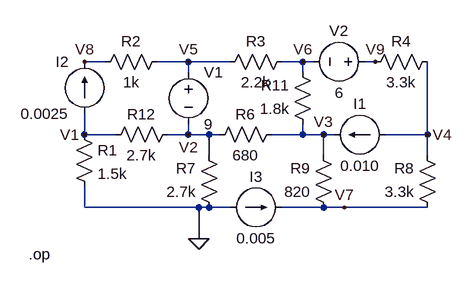
[diagram p0: schematic nodal14.asc]
nodal14.asc, the LTspice schematic file:
Version 4
SHEET 1 880 680
WIRE -32 -32 -64 -32
WIRE 96 -32 48 -32
WIRE 160 -32 96 -32
WIRE 272 -32 240 -32
WIRE 288 -32 272 -32
WIRE 384 -32 368 -32
WIRE 96 -16 96 -32
WIRE 272 -16 272 -32
WIRE -64 80 -64 48
WIRE -16 80 -64 80
WIRE 96 80 96 64
WIRE 96 80 64 80
WIRE 128 80 96 80
WIRE 144 80 128 80
WIRE 272 80 272 64
WIRE 272 80 224 80
WIRE 304 80 272 80
WIRE 320 80 304 80
WIRE 464 80 464 -32
WIRE 464 80 400 80
WIRE 128 112 128 80
WIRE 304 112 304 80
WIRE 464 112 464 80
WIRE -64 192 -64 160
WIRE 112 192 -64 192
WIRE 128 192 112 192
WIRE 160 192 128 192
WIRE 304 192 240 192
WIRE 336 192 304 192
WIRE 464 192 336 192
WIRE 112 240 112 192
FLAG 112 240 0
FLAG -64 80 V1
FLAG 96 80 V2
FLAG 304 80 V3
FLAG 464 80 V4
FLAG 96 -32 V5
FLAG 272 -32 V6
FLAG 336 192 V7
FLAG -64 -32 V8
FLAG 384 -32 V9
SYMBOL voltage 96 -32 R0
WINDOW 123 0 0 Left 0
WINDOW 39 0 0 Left 0
SYMATTR InstName V1
SYMATTR Value 9
SYMBOL voltage 384 -32 R90
WINDOW 0 -32 56 VBottom 2
WINDOW 3 32 56 VTop 2
WINDOW 123 0 0 Left 0
WINDOW 39 0 0 Left 0
SYMATTR InstName V2
SYMATTR Value 6
SYMBOL current 400 80 R90
WINDOW 0 -32 40 VBottom 2
WINDOW 3 32 40 VTop 2
WINDOW 123 0 0 Left 0
WINDOW 39 0 0 Left 0
SYMATTR InstName I1
SYMATTR Value 0.010
SYMBOL current -64 48 R180
WINDOW 0 24 80 Left 2
WINDOW 3 24 0 Left 2
WINDOW 123 0 0 Left 0
WINDOW 39 0 0 Left 0
SYMATTR InstName I2
SYMATTR Value 0.0025
SYMBOL res -80 64 R0
SYMATTR InstName R1
SYMATTR Value 1.5k
SYMBOL res 64 -48 R90
WINDOW 0 0 56 VBottom 2
WINDOW 3 32 56 VTop 2
SYMATTR InstName R2
SYMATTR Value 1k
SYMBOL res 256 -48 R90
WINDOW 0 0 56 VBottom 2
WINDOW 3 32 56 VTop 2
SYMATTR InstName R3
SYMATTR Value 2.2k
SYMBOL res 480 -48 R90
WINDOW 0 0 56 VBottom 2
WINDOW 3 32 56 VTop 2
SYMATTR InstName R4
SYMATTR Value 3.3k
SYMBOL res 240 64 R90
WINDOW 0 0 56 VBottom 2
WINDOW 3 32 56 VTop 2
SYMATTR InstName R6
SYMATTR Value 680
SYMBOL res 144 208 R180
WINDOW 0 36 76 Left 2
WINDOW 3 36 40 Left 2
SYMATTR InstName R7
SYMATTR Value 2.7k
SYMBOL res 480 208 R180
WINDOW 0 36 76 Left 2
WINDOW 3 36 40 Left 2
SYMATTR InstName R8
SYMATTR Value 3.3k
SYMBOL res 320 208 R180
WINDOW 0 36 76 Left 2
WINDOW 3 36 40 Left 2
SYMATTR InstName R9
SYMATTR Value 820
SYMBOL res -32 96 R270
WINDOW 0 32 56 VTop 2
WINDOW 3 0 56 VBottom 2
SYMATTR InstName R12
SYMATTR Value 2.7k
SYMBOL res 288 80 R180
WINDOW 0 36 76 Left 2
WINDOW 3 36 40 Left 2
SYMATTR InstName R11
SYMATTR Value 1.8k
SYMBOL current 160 192 R270
WINDOW 0 32 40 VTop 2
WINDOW 3 -32 40 VBottom 2
WINDOW 123 0 0 Left 0
WINDOW 39 0 0 Left 0
SYMATTR InstName I3
SYMATTR Value 0.005
TEXT -150 264 Left 2 !.op

The netlist it stands for:
* nodal14.asc
V1 V5 V2 9
V2 V9 V6 6
I1 V4 V3 0.010
I2 V1 V8 0.0025
R1 V1 0 1.5k
R2 V5 V8 1k
R3 V6 V5 2.2k
R4 V4 V9 3.3k
R6 V3 V2 680
R7 0 V2 2.7k
R8 V7 V4 3.3k
R9 V7 V3 820
R12 V1 V2 2.7k
R11 V3 V6 1.8k
I3 0 V7 0.005
.op
.backanno
.end